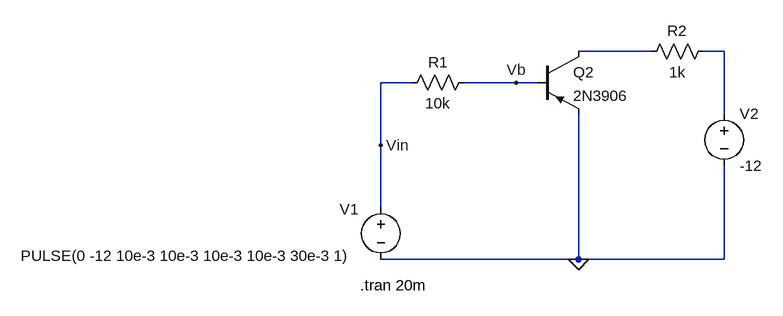
[diagram p0: schematic PNP.asc]
PNP.asc, the LTspice schematic file:
Version 4
SHEET 1 880 680
WIRE 352 80 240 80
WIRE 464 80 432 80
WIRE -16 128 -64 128
WIRE 144 128 64 128
WIRE 176 128 144 128
WIRE 464 176 464 80
WIRE -64 224 -64 128
WIRE -64 320 -64 224
WIRE 240 400 240 176
WIRE 240 400 -64 400
WIRE 464 400 464 256
WIRE 464 400 240 400
FLAG 144 128 Vb
FLAG -64 224 Vin
FLAG 240 400 0
SYMBOL res 80 112 R90
WINDOW 0 0 56 VBottom 2
WINDOW 3 32 56 VTop 2
SYMATTR InstName R1
SYMATTR Value 10k
SYMBOL res 336 96 R270
WINDOW 0 32 56 VTop 2
WINDOW 3 0 56 VBottom 2
SYMATTR InstName R2
SYMATTR Value 1k
SYMBOL voltage -64 304 R0
WINDOW 123 0 0 Left 0
WINDOW 39 0 0 Left 0
WINDOW 0 -63 19 Left 2
WINDOW 3 -554 90 Left 2
SYMATTR InstName V1
SYMATTR Value PULSE(0 -12 10e-3 10e-3 10e-3 10e-3 30e-3 1)
SYMBOL voltage 464 160 R0
WINDOW 123 0 0 Left 0
WINDOW 39 0 0 Left 0
SYMATTR InstName V2
SYMATTR Value -12
SYMBOL pnp 176 80 R0
SYMATTR InstName Q2
SYMATTR Value 2N3906
TEXT -96 440 Left 2 !.tran 20m

The netlist it stands for:
* PNP.asc
R1 Vb Vin 10k
R2 N001 N002 1k
V1 Vin 0 PULSE(0 -12 10e-3 10e-3 10e-3 10e-3 30e-3 1)
V2 N002 0 -12
Q2 N001 Vb 0 0 2N3906
.model NPN NPN
.model PNP PNP
.lib standard.bjt
.tran 20m
.backanno
.end